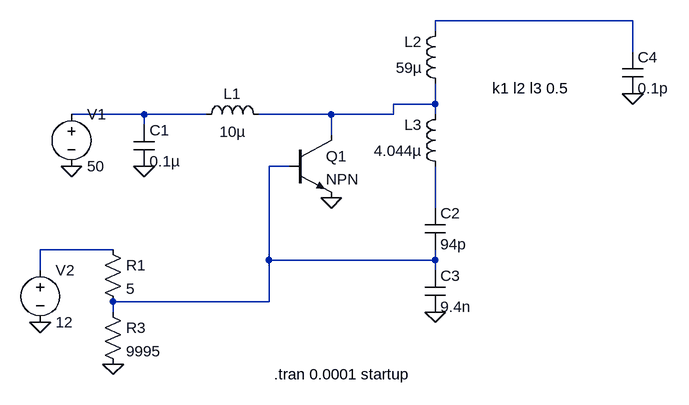
[diagram p0: schematic HFDRSSTC.asc]
HFDRSSTC.asc, the LTspice schematic file:
Version 4.1
SHEET 1 912 680
WIRE 848 -32 544 -32
WIRE 544 -16 544 -32
WIRE 848 16 848 -32
WIRE 544 96 544 64
WIRE 544 96 480 96
WIRE 96 112 -16 112
WIRE 192 112 96 112
WIRE 384 112 272 112
WIRE 480 112 480 96
WIRE 480 112 384 112
WIRE 544 112 544 96
WIRE 96 128 96 112
WIRE 384 144 384 112
WIRE 320 192 288 192
WIRE 544 256 544 192
WIRE 48 320 -64 320
WIRE 288 336 288 192
WIRE 544 336 544 320
WIRE 544 336 288 336
WIRE -64 352 -64 320
WIRE 544 352 544 336
WIRE 288 400 288 336
WIRE 288 400 48 400
WIRE 48 416 48 400
FLAG -16 192 0
FLAG 96 192 0
FLAG 544 416 0
FLAG 48 496 0
FLAG -64 432 0
FLAG 848 80 0
FLAG 384 240 0
SYMBOL voltage -16 96 R0
WINDOW 123 0 0 Left 0
WINDOW 39 0 0 Left 0
SYMATTR InstName V1
SYMATTR Value 50
SYMBOL cap 80 128 R0
SYMATTR InstName C1
SYMATTR Value 0.1µ
SYMBOL ind 176 128 R270
WINDOW 0 32 56 VTop 2
WINDOW 3 5 56 VBottom 2
SYMATTR InstName L1
SYMATTR Value 10µ
SYMBOL cap 528 256 R0
SYMATTR InstName C2
SYMATTR Value 94p
SYMBOL cap 528 352 R0
SYMATTR InstName C3
SYMATTR Value 9.4n
SYMBOL res 32 304 R0
SYMATTR InstName R1
SYMATTR Value 5
SYMBOL res 32 400 R0
SYMATTR InstName R3
SYMATTR Value 9995
SYMBOL voltage -64 336 R0
WINDOW 123 0 0 Left 0
WINDOW 39 0 0 Left 0
SYMATTR InstName V2
SYMATTR Value 12
SYMBOL ind 560 80 R180
WINDOW 0 36 80 Left 2
WINDOW 3 36 40 Left 2
SYMATTR InstName L2
SYMATTR Value 59µ
SYMATTR Type ind
SYMBOL ind 560 208 R180
WINDOW 0 36 80 Left 2
WINDOW 3 36 40 Left 2
SYMATTR InstName L3
SYMATTR Value 4.044µ
SYMATTR Type ind
SYMBOL cap 832 16 R0
SYMATTR InstName C4
SYMATTR Value 0.1p
SYMBOL npn 320 144 R0
SYMATTR InstName Q1
TEXT 632 72 Left 2 !k1 l2 l3 0.5
TEXT 296 512 Left 2 !.tran 0.0001 startup

The netlist it stands for:
* HFDRSSTC.asc
V1 N003 0 50
C1 N003 0 0.1µ
L1 N003 N002 10µ
C2 N005 N004 94p
C3 N004 0 9.4n
R1 N006 N004 5
R3 N004 0 9995
V2 N006 0 12
L2 N002 N001 59µ
L3 N005 N002 4.044µ
C4 N001 0 0.1p
Q1 N002 N004 0 0 NPN
.model NPN NPN
.model PNP PNP
.lib standard.bjt
k1 l2 l3 0.5
.tran 0.0001 startup
.backanno
.end